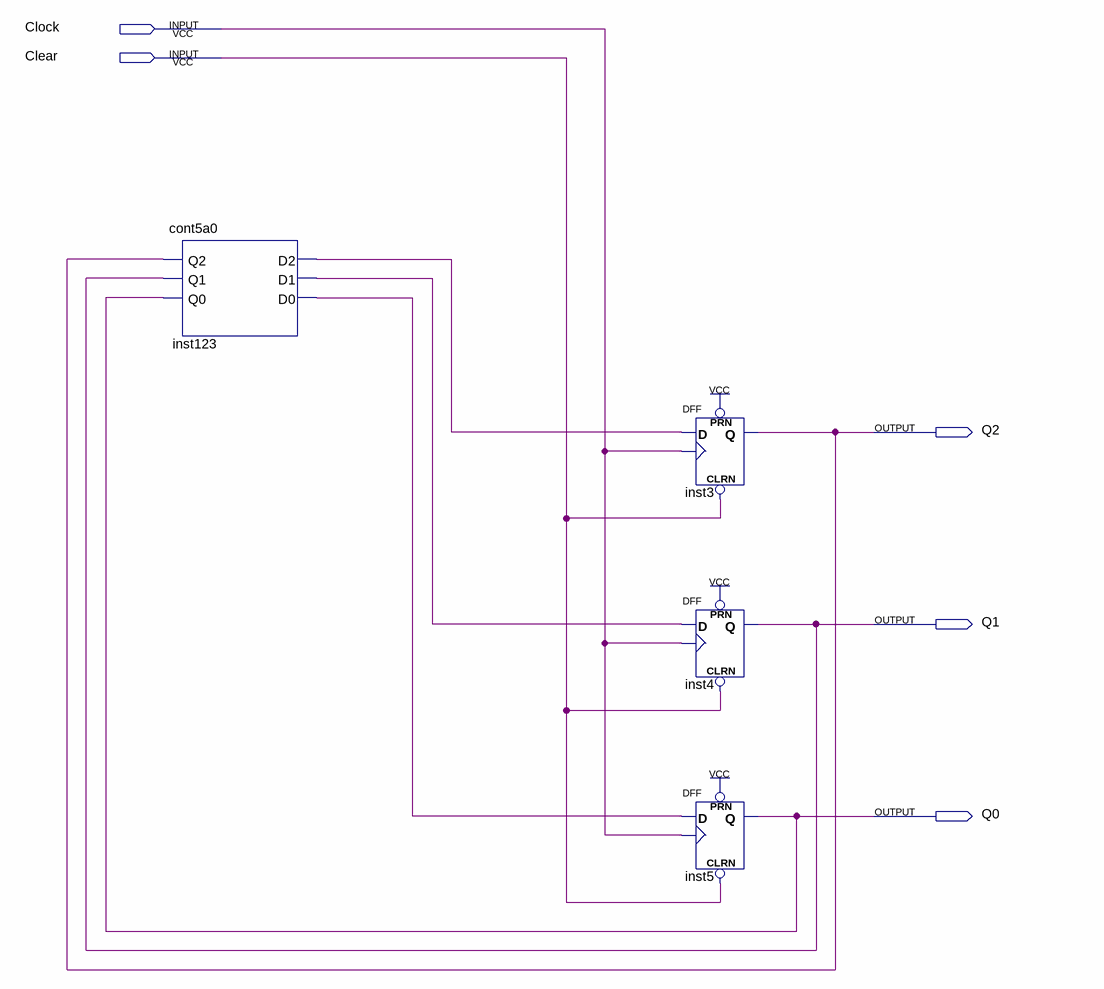
[diagram p0: schematic sheet]
// Quartus schematic Contador5a0.bdf as structural Verilog: 4 symbols, 5 pins
module Contador5a0 (
  input  Clock,
  input  Clear,
  output Q2,
  output Q1,
  output Q0
);

  wire inst123_d0, inst123_d1, inst123_d2;

  cont5a0 inst123 (.Q2(Q2), .Q1(Q1), .Q0(Q0), .D2(inst123_d2), .D1(inst123_d1), .D0(inst123_d0));
  DFF inst3 (.CLRN(Clear), .CLK(Clock), .D(inst123_d2), .PRN(1'b1), .Q(Q2));
  DFF inst4 (.CLRN(Clear), .CLK(Clock), .D(inst123_d1), .PRN(1'b1), .Q(Q1));
  DFF inst5 (.CLRN(Clear), .CLK(Clock), .D(inst123_d0), .PRN(1'b1), .Q(Q0));
endmodule
